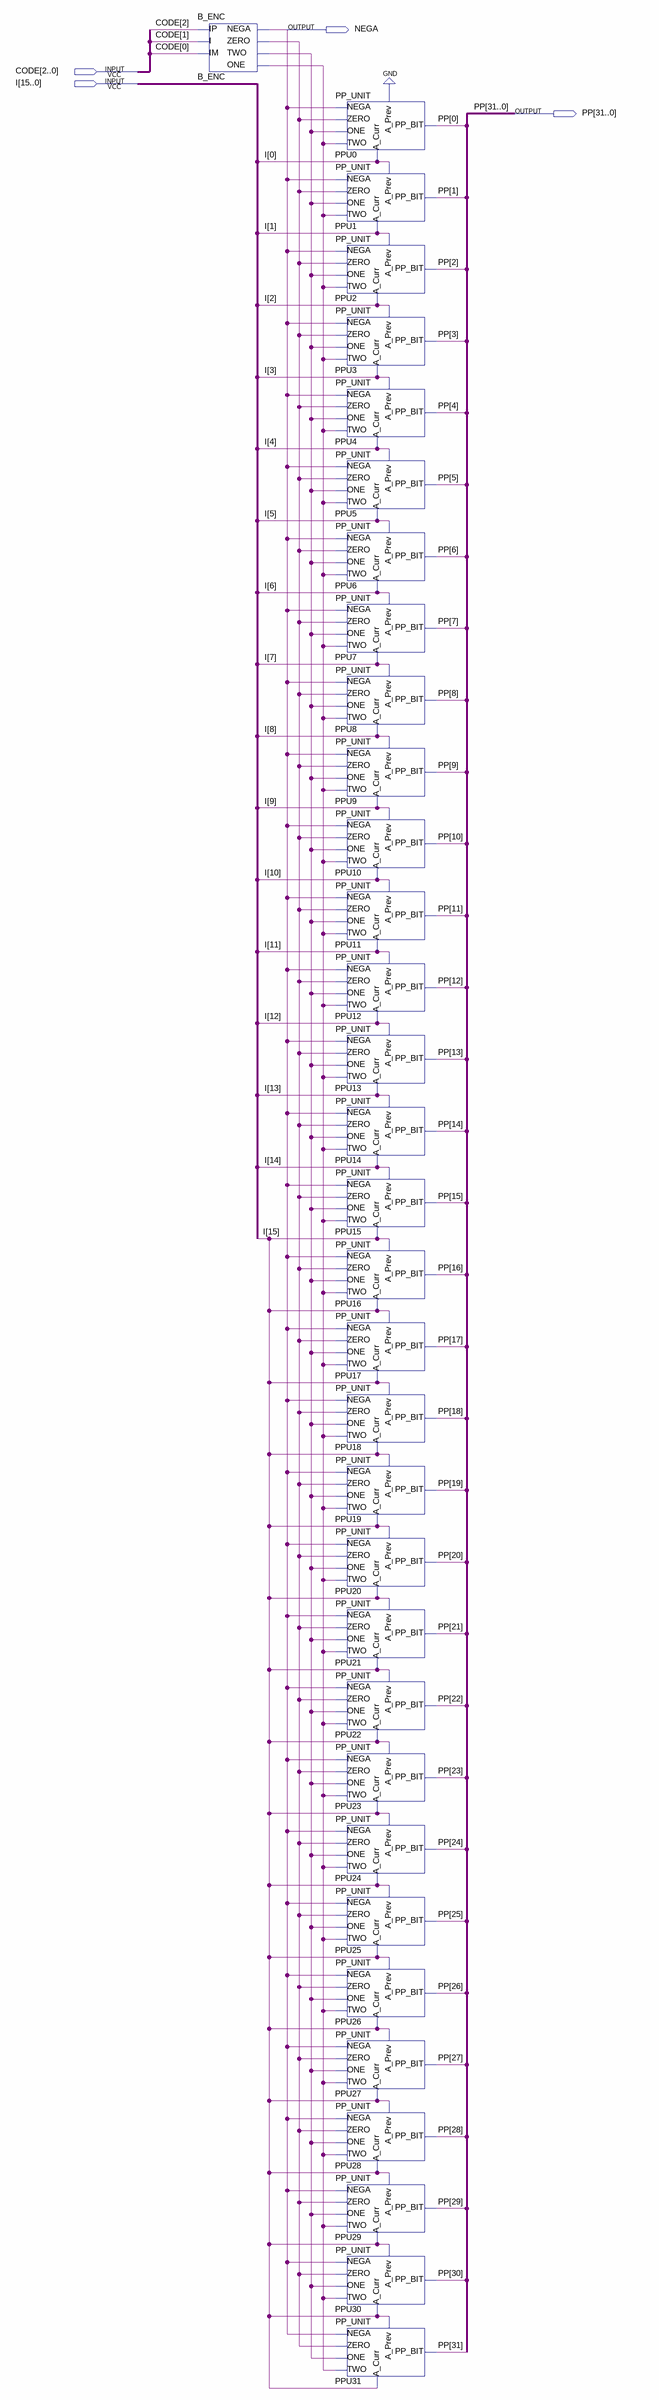
[diagram p0: schematic sheet]
// Quartus schematic PP_ROW_GEN.bdf as structural Verilog: 33 symbols, 4 pins
module PP_ROW_GEN (
  input  [2:0] CODE,
  input  [15:0] I,
  output NEGA,
  output [31:0] PP
);

  wire B_ENC_one, B_ENC_two, B_ENC_zero;

  B_ENC B_ENC (
    .IP(CODE[2]), .I(CODE[1]), .IM(CODE[0]), .NEGA(NEGA), .ZERO(B_ENC_zero), .TWO(B_ENC_two), .ONE(B_ENC_one));
  PP_UNIT PPU0 (
    .NEGA(NEGA), .ZERO(B_ENC_zero), .ONE(B_ENC_two), .TWO(B_ENC_one), .A_Curr(I[0]), .A_Prev(1'b0),
    .PP_BIT(PP[0]));
  PP_UNIT PPU1 (
    .NEGA(NEGA), .ZERO(B_ENC_zero), .ONE(B_ENC_two), .TWO(B_ENC_one), .A_Curr(I[1]), .A_Prev(I[0]),
    .PP_BIT(PP[1]));
  PP_UNIT PPU2 (
    .NEGA(NEGA), .ZERO(B_ENC_zero), .ONE(B_ENC_two), .TWO(B_ENC_one), .A_Curr(I[2]), .A_Prev(I[1]),
    .PP_BIT(PP[2]));
  PP_UNIT PPU3 (
    .NEGA(NEGA), .ZERO(B_ENC_zero), .ONE(B_ENC_two), .TWO(B_ENC_one), .A_Curr(I[3]), .A_Prev(I[2]),
    .PP_BIT(PP[3]));
  PP_UNIT PPU4 (
    .NEGA(NEGA), .ZERO(B_ENC_zero), .ONE(B_ENC_two), .TWO(B_ENC_one), .A_Curr(I[4]), .A_Prev(I[3]),
    .PP_BIT(PP[4]));
  PP_UNIT PPU5 (
    .NEGA(NEGA), .ZERO(B_ENC_zero), .ONE(B_ENC_two), .TWO(B_ENC_one), .A_Curr(I[5]), .A_Prev(I[4]),
    .PP_BIT(PP[5]));
  PP_UNIT PPU6 (
    .NEGA(NEGA), .ZERO(B_ENC_zero), .ONE(B_ENC_two), .TWO(B_ENC_one), .A_Curr(I[6]), .A_Prev(I[5]),
    .PP_BIT(PP[6]));
  PP_UNIT PPU7 (
    .NEGA(NEGA), .ZERO(B_ENC_zero), .ONE(B_ENC_two), .TWO(B_ENC_one), .A_Curr(I[7]), .A_Prev(I[6]),
    .PP_BIT(PP[7]));
  PP_UNIT PPU8 (
    .NEGA(NEGA), .ZERO(B_ENC_zero), .ONE(B_ENC_two), .TWO(B_ENC_one), .A_Curr(I[8]), .A_Prev(I[7]),
    .PP_BIT(PP[8]));
  PP_UNIT PPU9 (
    .NEGA(NEGA), .ZERO(B_ENC_zero), .ONE(B_ENC_two), .TWO(B_ENC_one), .A_Curr(I[9]), .A_Prev(I[8]),
    .PP_BIT(PP[9]));
  PP_UNIT PPU10 (
    .NEGA(NEGA), .ZERO(B_ENC_zero), .ONE(B_ENC_two), .TWO(B_ENC_one), .A_Curr(I[10]), .A_Prev(I[9]),
    .PP_BIT(PP[10]));
  PP_UNIT PPU11 (
    .NEGA(NEGA), .ZERO(B_ENC_zero), .ONE(B_ENC_two), .TWO(B_ENC_one), .A_Curr(I[11]), .A_Prev(I[10]),
    .PP_BIT(PP[11]));
  PP_UNIT PPU12 (
    .NEGA(NEGA), .ZERO(B_ENC_zero), .ONE(B_ENC_two), .TWO(B_ENC_one), .A_Curr(I[12]), .A_Prev(I[11]),
    .PP_BIT(PP[12]));
  PP_UNIT PPU13 (
    .NEGA(NEGA), .ZERO(B_ENC_zero), .ONE(B_ENC_two), .TWO(B_ENC_one), .A_Curr(I[13]), .A_Prev(I[12]),
    .PP_BIT(PP[13]));
  PP_UNIT PPU14 (
    .NEGA(NEGA), .ZERO(B_ENC_zero), .ONE(B_ENC_two), .TWO(B_ENC_one), .A_Curr(I[14]), .A_Prev(I[13]),
    .PP_BIT(PP[14]));
  PP_UNIT PPU15 (
    .NEGA(NEGA), .ZERO(B_ENC_zero), .ONE(B_ENC_two), .TWO(B_ENC_one), .A_Curr(I[15]), .A_Prev(I[14]),
    .PP_BIT(PP[15]));
  PP_UNIT PPU16 (
    .NEGA(NEGA), .ZERO(B_ENC_zero), .ONE(B_ENC_two), .TWO(B_ENC_one), .A_Curr(I[15]), .A_Prev(I[15]),
    .PP_BIT(PP[16]));
  PP_UNIT PPU17 (
    .NEGA(NEGA), .ZERO(B_ENC_zero), .ONE(B_ENC_two), .TWO(B_ENC_one), .A_Curr(I[15]), .A_Prev(I[15]),
    .PP_BIT(PP[17]));
  PP_UNIT PPU18 (
    .NEGA(NEGA), .ZERO(B_ENC_zero), .ONE(B_ENC_two), .TWO(B_ENC_one), .A_Curr(I[15]), .A_Prev(I[15]),
    .PP_BIT(PP[18]));
  PP_UNIT PPU19 (
    .NEGA(NEGA), .ZERO(B_ENC_zero), .ONE(B_ENC_two), .TWO(B_ENC_one), .A_Curr(I[15]), .A_Prev(I[15]),
    .PP_BIT(PP[19]));
  PP_UNIT PPU20 (
    .NEGA(NEGA), .ZERO(B_ENC_zero), .ONE(B_ENC_two), .TWO(B_ENC_one), .A_Curr(I[15]), .A_Prev(I[15]),
    .PP_BIT(PP[20]));
  PP_UNIT PPU21 (
    .NEGA(NEGA), .ZERO(B_ENC_zero), .ONE(B_ENC_two), .TWO(B_ENC_one), .A_Curr(I[15]), .A_Prev(I[15]),
    .PP_BIT(PP[21]));
  PP_UNIT PPU22 (
    .NEGA(NEGA), .ZERO(B_ENC_zero), .ONE(B_ENC_two), .TWO(B_ENC_one), .A_Curr(I[15]), .A_Prev(I[15]),
    .PP_BIT(PP[22]));
  PP_UNIT PPU23 (
    .NEGA(NEGA), .ZERO(B_ENC_zero), .ONE(B_ENC_two), .TWO(B_ENC_one), .A_Curr(I[15]), .A_Prev(I[15]),
    .PP_BIT(PP[23]));
  PP_UNIT PPU24 (
    .NEGA(NEGA), .ZERO(B_ENC_zero), .ONE(B_ENC_two), .TWO(B_ENC_one), .A_Curr(I[15]), .A_Prev(I[15]),
    .PP_BIT(PP[24]));
  PP_UNIT PPU25 (
    .NEGA(NEGA), .ZERO(B_ENC_zero), .ONE(B_ENC_two), .TWO(B_ENC_one), .A_Curr(I[15]), .A_Prev(I[15]),
    .PP_BIT(PP[25]));
  PP_UNIT PPU26 (
    .NEGA(NEGA), .ZERO(B_ENC_zero), .ONE(B_ENC_two), .TWO(B_ENC_one), .A_Curr(I[15]), .A_Prev(I[15]),
    .PP_BIT(PP[26]));
  PP_UNIT PPU27 (
    .NEGA(NEGA), .ZERO(B_ENC_zero), .ONE(B_ENC_two), .TWO(B_ENC_one), .A_Curr(I[15]), .A_Prev(I[15]),
    .PP_BIT(PP[27]));
  PP_UNIT PPU28 (
    .NEGA(NEGA), .ZERO(B_ENC_zero), .ONE(B_ENC_two), .TWO(B_ENC_one), .A_Curr(I[15]), .A_Prev(I[15]),
    .PP_BIT(PP[28]));
  PP_UNIT PPU29 (
    .NEGA(NEGA), .ZERO(B_ENC_zero), .ONE(B_ENC_two), .TWO(B_ENC_one), .A_Curr(I[15]), .A_Prev(I[15]),
    .PP_BIT(PP[29]));
  PP_UNIT PPU30 (
    .NEGA(NEGA), .ZERO(B_ENC_zero), .ONE(B_ENC_two), .TWO(B_ENC_one), .A_Curr(I[15]), .A_Prev(I[15]),
    .PP_BIT(PP[30]));
  PP_UNIT PPU31 (
    .NEGA(NEGA), .ZERO(B_ENC_zero), .ONE(B_ENC_two), .TWO(B_ENC_one), .A_Curr(I[15]), .A_Prev(I[15]),
    .PP_BIT(PP[31]));
endmodule
